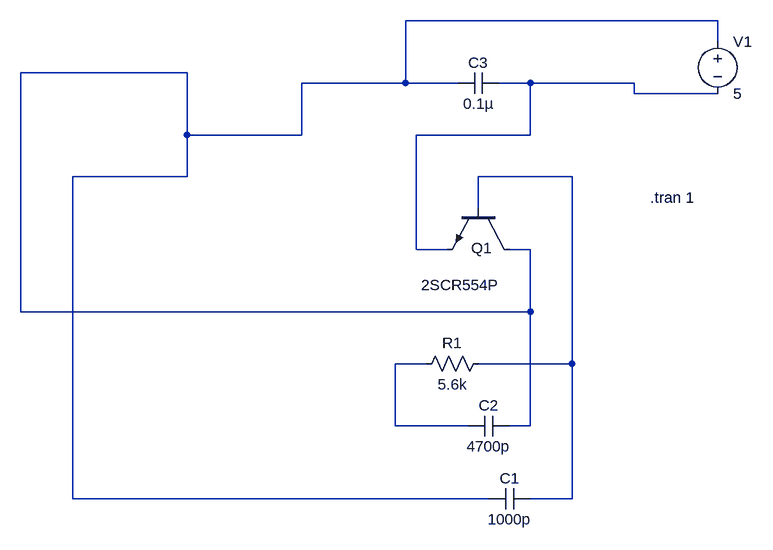
[diagram p0: schematic 37#24.5_1.(1).asc]
37#24.5_1.(1).asc, the LTspice schematic file:
Version 4
SHEET 1 880 680
WIRE 208 -416 -272 -416
WIRE 208 -384 208 -416
WIRE -608 -336 -864 -336
WIRE -272 -320 -272 -416
WIRE -272 -320 -432 -320
WIRE -192 -320 -272 -320
WIRE -80 -320 -128 -320
WIRE 80 -320 -80 -320
WIRE 80 -304 80 -320
WIRE 208 -304 80 -304
WIRE -608 -240 -608 -336
WIRE -432 -240 -432 -320
WIRE -432 -240 -608 -240
WIRE -80 -240 -80 -320
WIRE -80 -240 -256 -240
WIRE -608 -176 -608 -240
WIRE -608 -176 -784 -176
WIRE -16 -176 -160 -176
WIRE -160 -128 -160 -176
WIRE -256 -64 -256 -240
WIRE -208 -64 -256 -64
WIRE -80 -64 -112 -64
WIRE -864 32 -864 -336
WIRE -80 32 -80 -64
WIRE -80 32 -864 32
WIRE -240 112 -288 112
WIRE -16 112 -16 -176
WIRE -16 112 -160 112
WIRE -288 208 -288 112
WIRE -176 208 -288 208
WIRE -80 208 -80 32
WIRE -80 208 -112 208
WIRE -784 320 -784 -176
WIRE -144 320 -784 320
WIRE -16 320 -16 112
WIRE -16 320 -80 320
SYMBOL npn -112 -128 R90
WINDOW 0 62 27 VRight 2
WINDOW 3 119 16 VRight 2
SYMATTR InstName Q1
SYMATTR Value 2SCR554P
SYMBOL cap -80 304 R90
WINDOW 0 0 32 VBottom 2
WINDOW 3 32 32 VTop 2
SYMATTR InstName C1
SYMATTR Value 1000p
SYMATTR SpiceLine V=100
SYMBOL cap -112 192 R90
WINDOW 0 0 32 VBottom 2
WINDOW 3 32 32 VTop 2
SYMATTR InstName C2
SYMATTR Value 4700p
SYMATTR SpiceLine V=100
SYMBOL cap -128 -336 R90
WINDOW 0 0 32 VBottom 2
WINDOW 3 32 32 VTop 2
SYMATTR InstName C3
SYMATTR Value 0.1µ
SYMATTR SpiceLine V=63
SYMBOL res -144 96 R90
WINDOW 0 0 56 VBottom 2
WINDOW 3 32 56 VTop 2
SYMATTR InstName R1
SYMATTR Value 5.6k
SYMATTR SpiceLine pwr=0.5
SYMBOL voltage 208 -400 R0
WINDOW 123 0 0 Left 2
WINDOW 39 0 0 Left 2
SYMATTR InstName V1
SYMATTR Value 5
TEXT 104 -144 Left 2 !.tran 1

The netlist it stands for:
* 37#24.5_1.(1).asc
Q1 N001 N003 N002 0 2SCR554P
C1 N003 N001 1000p V=100
C2 N001 N004 4700p V=100
C3 N002 N001 0.1µ V=63
R1 N003 N004 5.6k pwr=0.5
V1 N001 N002 5
.model NPN NPN
.model PNP PNP
.lib standard.bjt
.tran 1
.backanno
.end